# Altium project RM-KM-CS.PrjPcb
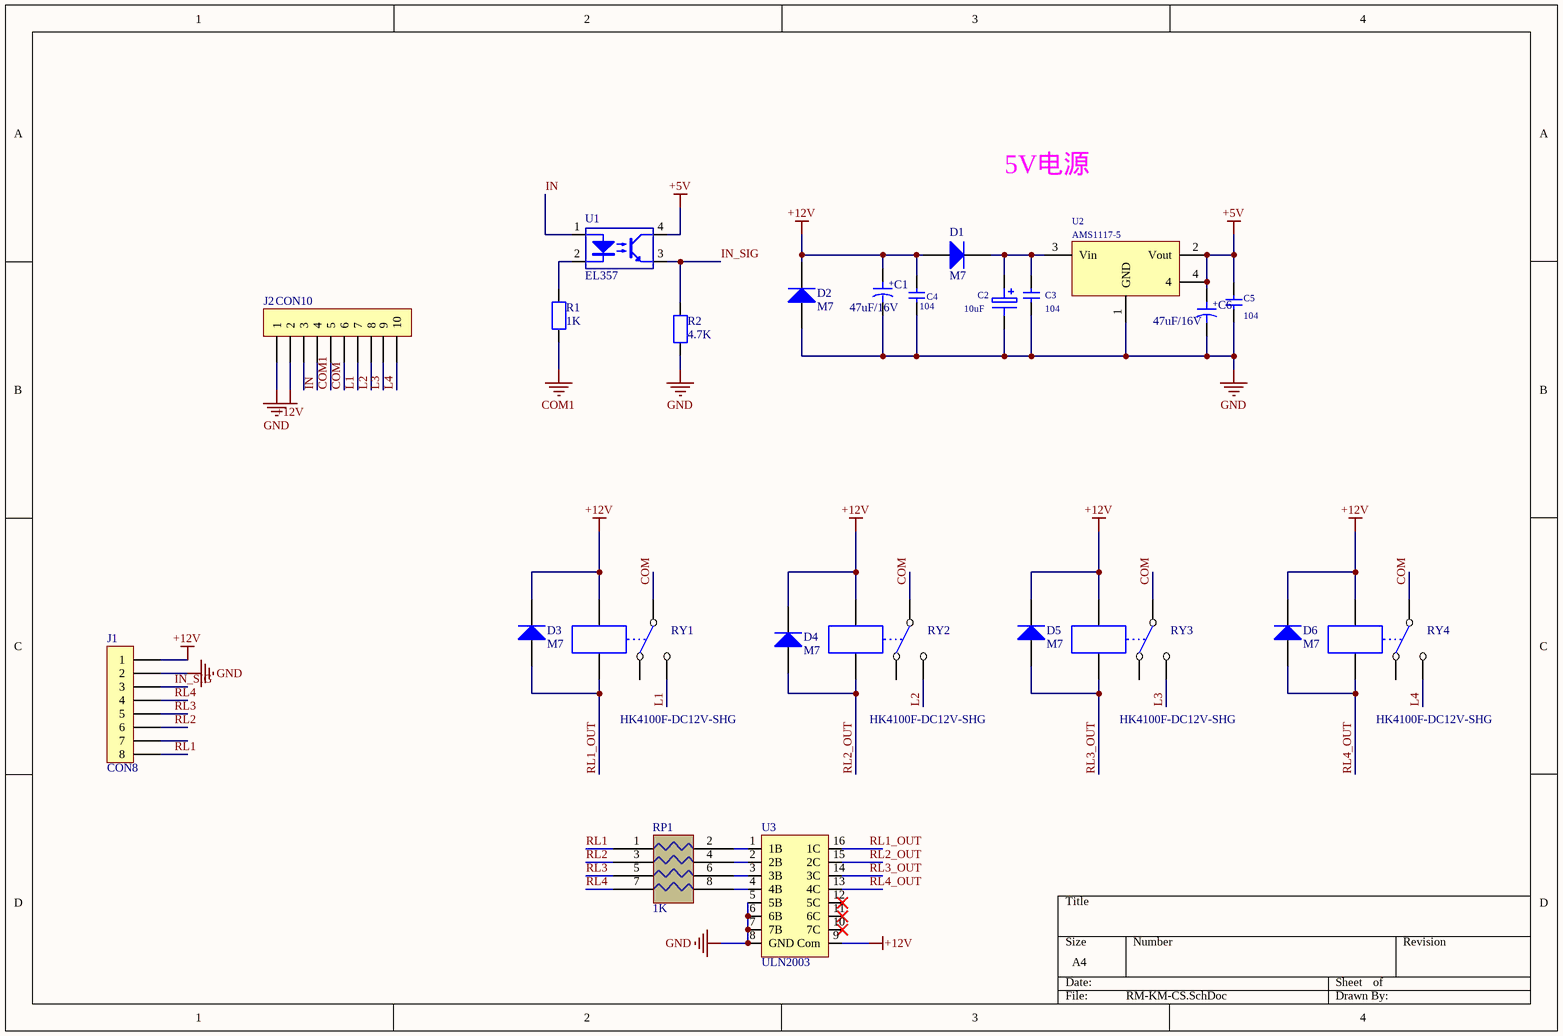
[diagram p0: RM-KM-CS.SchDoc]
1 sheet, 24 parts. Net scope: global (net labels, ports and power ports of the same name join across sheets).
Board file: RM-KM-CS  V1.0.PcbDoc

## Sheet RM-KM-CS.SchDoc
size A4

### Parts
C1  47uF/16V  [100uF/16V]
C2  10uF  [1206C]
C3  104  [0805C]
C4  104  [0805C]
C5  104  [0805C]
C6  47uF/16V  [100uF/16V]
D1  M7  [M7]
D2  M7  [M7]
D3  M7  [M7]
D4  M7  [M7]
D5  M7  [M7]
D6  M7  [M7]
J1  CON8  [DIP-8P-2.0 -1]
J2  CON10  [SPI-10P-5.0_S]
R1  1K  [0805R]
R2  4.7K  [0805R]
RP1  1K  [RP_4P_0603_SMD]
RY1  HK4100F-DC12V-SHG  [RELAY]
RY2  HK4100F-DC12V-SHG  [RELAY]
RY3  HK4100F-DC12V-SHG  [RELAY]
RY4  HK4100F-DC12V-SHG  [RELAY]
U1  EL357  [EL357]
U2  AMS1117-5  [SOT-223]
U3  ULN2003  [SOIC16]

### Nets
+5V: C5.1 C6.1 U1.4(Collector) U2.2(Vout) U2.4
+12V: C1.1 C4.1 D1.A D2.K D3.K D4.K D5.K D6.K J1.1 J2.2 RY1.2 RY2.2 RY3.2 RY4.2 U3.9(Com)
COM1: J2.5 R1.1
GND: C1.2 C2.2 C3.2 C4.2 C5.2 C6.2 D2.A J1.2 J2.1 R2.1 U2.1(GND) U3.5(5B) U3.6(6B) U3.7(7B) U3.8(GND)
COM: J2.6 RY1.1 RY2.1 RY3.1 RY4.1
IN: J2.4 U1.1(LED_Anode)
IN_SIG: J1.3 R2.2 U1.3(Emitter)
L1: J2.7 RY1.4
L2: J2.8 RY2.4
L3: J2.9 RY3.4
L4: J2.10 RY4.4
RL1: J1.8 RP1.1
RL1_OUT: D3.A RY1.5 U3.16(1C)
RL2: J1.6 RP1.3
RL2_OUT: D4.A RY2.5 U3.15(2C)
RL3: J1.5 RP1.5
RL3_OUT: D5.A RY3.5 U3.14(3C)
RL4: J1.4 RP1.7
RL4_OUT: D6.A RY4.5 U3.13(4C)
NetC2_1: C2.1 C3.1 D1.K U2.3(Vin)
NetR1_2: R1.2 U1.2(LED_Cathode)
NetRP1_2: RP1.2 U3.1(1B)
NetRP1_4: RP1.4 U3.2(2B)
NetRP1_6: RP1.6 U3.3(3B)
NetRP1_8: RP1.8 U3.4(4B)

Not connected (* = marked no-connect by the designer): J1 7; J2 3; RY1 3; RY2 3; RY3 3; RY4 3; U3 10(7C)* 11(6C)* 12(5C)*

### Notes on the sheet
- 5V电源
- (in symbol ECAP) +

### Library data of the parts
C1 C6 = ECAP
C2 = ELECTRO1: Electrolytic Capacitor
C3-C5 = CAP
R1 R2 = RES
RP1 = RP-RESISTOR: RP_0603_SMD
RY1-RY4 = RELAY5V
U1 = 817
U2 = VOL
U3 = UNL2003